# EAGLE design SEMLIC V2 (EAGLE 9.6.2)
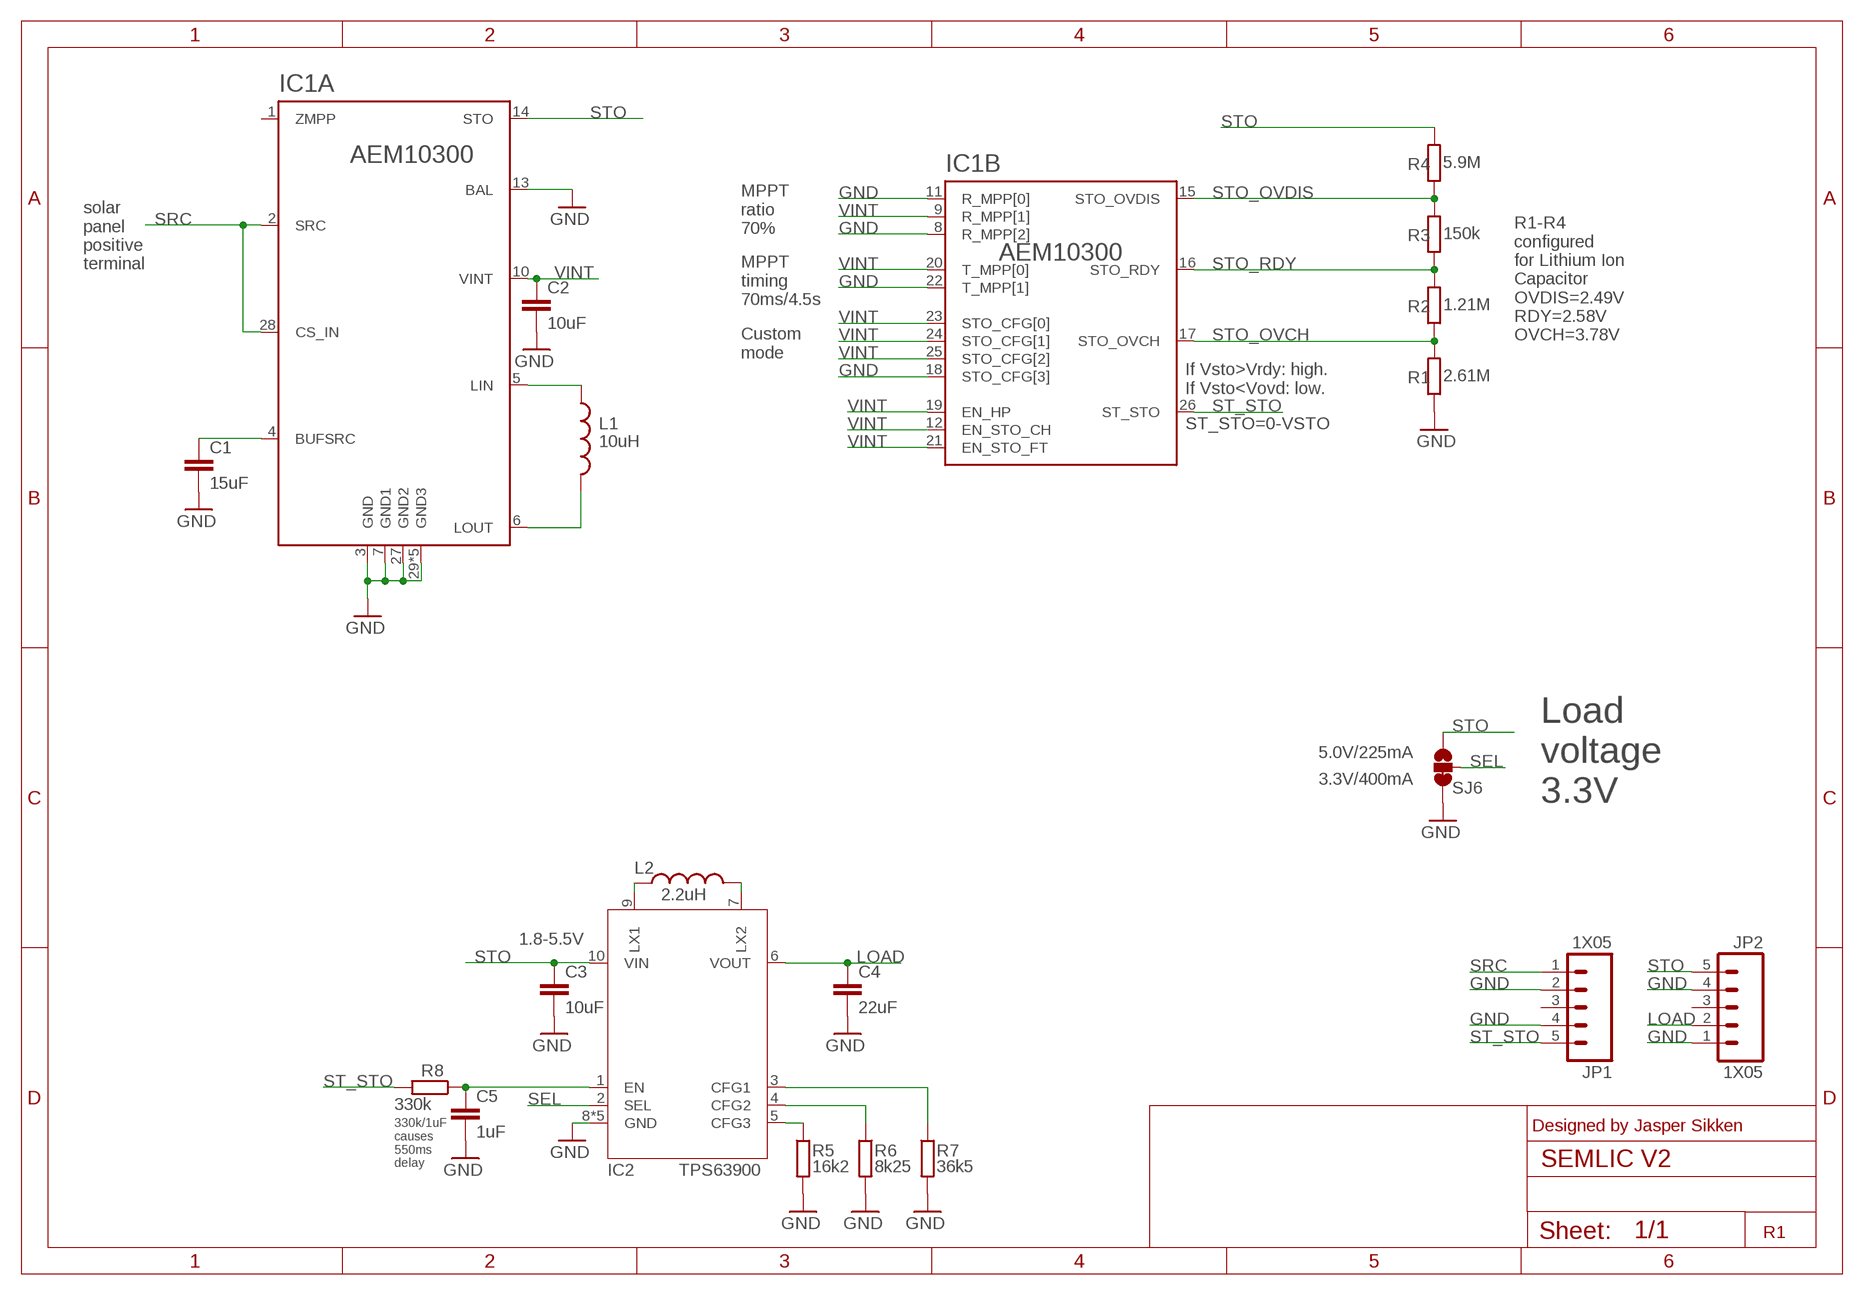
[diagram p0: schematic, sheet 1]

## Parts
C1  15uF  C_0402  [C0402]
C2  10uF  C_0402  [C0402]
C3  10uF  C0603_10UF  [C0603]
C4  22uF  C0603_22UF  [C0603]
C5  1uF  C_0402  [C0402]
IC1  AEM10300  [QFN28P4X4]
IC2  TPS63900  [WSON10]
JP1  1X05  [1X05_2.54MM_ROUND_NOSILK]
JP2  1X05  [1X05_2.54MM_ROUND_NOSILK]
L1  10uH  L  [L_1008_[2520]]
L2  2.2uH  L2  [L_1008_[2520]]
R1  2.61M  R0402_1M  [R0402]
R2  1.21M  R0402_1M  [R0402]
R3  150k  R0402_1M  [R0402]
R4  5.9M  R0402_1M  [R0402]
R5  16k2  R0402_1M  [R0402]
R6  8k25  R0402_1M  [R0402]
R7  36k5  R0402_1M  [R0402]
R8  330k  R0402_1M  [R0402]
SJ6  SOLDERJUMPER_3WAY_12SHORT3WAY  [SJ_3S_NC_0402]

## Nets
BUFSRC: C1.1 IC1.4(A:BUFSRC)
GND: C1.2 C2.2 C3.2 C4.2 C5.2 IC1.3(A:GND) IC1.7(A:GND1) IC1.8(B:R_MPP[2]) IC1.11(B:R_MPP[0]) IC1.13(A:BAL) IC1.18(B:STO_CFG[3]) IC1.22(B:T_MPP[1]) IC1.27(A:GND2) IC1.29(A:GND3) IC1.P$1(A:GND3) IC1.P$2(A:GND3) IC1.P$3(A:GND3) IC1.P$4(A:GND3) IC2.8(GND) IC2.29(GND) IC2.P$2(GND) IC2.P$4(GND) IC2.P$5(GND) JP1.2 JP1.4 JP2.1 JP2.4 R1.1 R5.2 R6.2 R7.2 SJ6.1
LIN: IC1.5(A:LIN) L1.1
LOAD: C4.1 IC2.6(VOUT) JP2.2
LOUT: IC1.6(A:LOUT) L1.2
N$2: IC2.9(LX1) L2.1
N$3: IC2.7(LX2) L2.2
N$4: IC2.5(CFG3) R5.1
N$5: IC2.4(CFG2) R6.1
N$6: IC2.3(CFG1) R7.1
SEL: IC2.2(SEL) SJ6.2
SRC: IC1.2(A:SRC) IC1.28(A:CS_IN) JP1.1
ST_STO: IC1.26(B:ST_STO) JP1.5 R8.2
STO: C3.1 IC1.14(A:STO) IC2.10(VIN) JP2.5 R4.2 SJ6.3
STO_OVCH: IC1.17(B:STO_OVCH) R1.2 R2.1
STO_OVDIS: IC1.15(B:STO_OVDIS) R3.2 R4.1
STO_RDY: IC1.16(B:STO_RDY) R2.2 R3.1
TPS_EN: C5.1 IC2.1(EN) R8.1
VINT: C2.1 IC1.9(B:R_MPP[1]) IC1.10(A:VINT) IC1.12(B:EN_STO_CH) IC1.19(B:EN_HP) IC1.20(B:T_MPP[0]) IC1.21(B:EN_STO_FT) IC1.23(B:STO_CFG[0]) IC1.24(B:STO_CFG[1]) IC1.25(B:STO_CFG[2])
Unconnected: IC1.1(A:ZMPP) JP1.3 JP2.3

## Notes on the sheet
- MPPT
  ratio
  70%
- solar
  panel
  positive
  terminal
- MPPT
  timing
  70ms/4.5s
- R1-R4 
  configured 
  for Lithium Ion 
  Capacitor
  OVDIS=2.49V
  RDY=2.58V
  OVCH=3.78V
- Custom 
  mode
- If Vsto>Vrdy: high.
  If Vsto<Vovd: low.
- ST_STO=0-VSTO
- 5.0V/225mA
- 3.3V/400mA
- Load 
  voltage
  3.3V
- 1.8-5.5V
- Designed by Jasper Sikken
- 330k/1uF 
  causes 
  550ms 
  delay
- R1

## Library data of the parts
C1 C2 C5 = TSEM:C: Non-polarized capacitor
C3 = TSEM:C: Non-polarized capacitor; FARNELL_OC: 2113070; MF: Taiyo Yuden; MPN: LMK107BBJ106MALT
C4 = TSEM:C: Non-polarized capacitor; FARNELL_OC: 2426957; MF: Murata; MPN: GRM188R61A226ME15D; VALUE: 22uF 10V
IC1 = TSEM:AEM10300: Ambient Energy Manager from e-peas
IC2 = TSEM:TPS63900: TPS63900 1.8-V to 5.5-V, 75-nA IQ Buck-boost Converter with Input Current Limit and DVS
JP1 JP2 = TSEM:1X05; OC_NEWARK: unknown
L1 = TSEM:L: Inductor; MF: MURATA; MPN: DFE252010F-100
L2 = TSEM:L: Inductor; MF: Murata; MPN: DFE252012F-2R2M=P2
R1-R8 = TSEM:R: Resistor; FARNELL_OC: 2502499; OC_NEWARK: unknown; VALUE: 1M
SJ6 = sodaq:SOLDERJUMPER_3WAY_12SHORT; OC_NEWARK: unknown

## Board
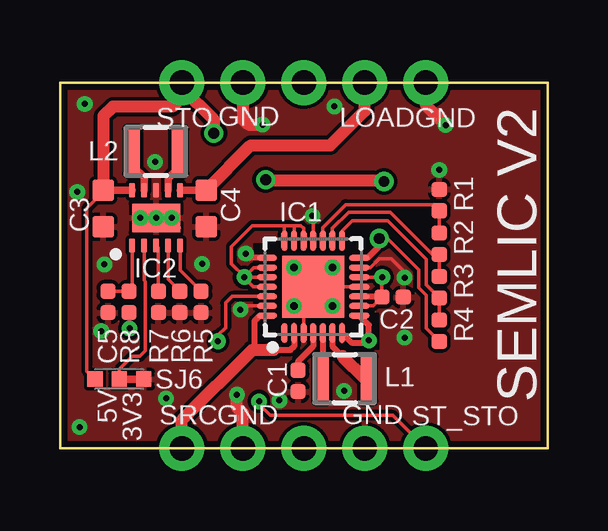
[diagram p1: board, top side]
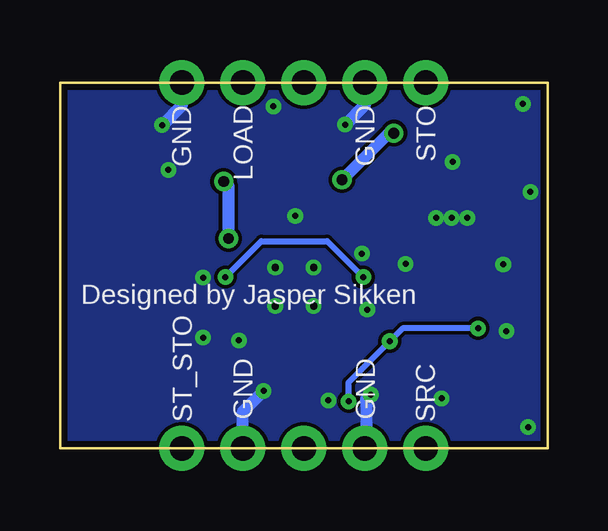
[diagram p2: board, bottom side, seen from below]

Size 20.32 x 15.24 mm. Coordinates in mm from the lower left corner, seen from the top.
Outline: 0,0 0,15.24 20.32,15.24 20.32,0 0,0
Copper layers (1*16): Top 0.018mm / dielectric 1.55mm / Bottom 0.018mm
Design rules "eC_2Layer_PClass6_BaseCopperO18_eCDefault *": minimum track width 0.15mm, minimum drill 0.25mm, track to track 0.15mm, track to pad 0.15mm, pad to pad 0.15mm, via to via 0.15mm, smd to smd 0mil, copper to edge 0.25mm, drill to drill 0.35mm, minimum pad ring 0.175mm, minimum via ring 0.125mm, stop-mask expansion 0.03mm, vias tented up to drill 0.45mm, thermal gap 0.15mm
tRestrict: area 11.6,4.2 to 13.2,5.6; area 8.1,7.8 to 9.1,8.5; area 8.1,5.8 to 8.9,6.1; area 10.4,8.5 to 10.8,9.3; area 12.3,7.4 to 13.1,7.7

### Footprints (pad centres in the part's own frame; a part is rotated, then mirrored left to right if it is on the bottom)
C0402 = smd 0.635 x 0.635: 1 -0.445,0; 2 0.445,0
C0603 = smd 0.889 x 0.889: 1 -0.762,0; 2 0.762,0
QFN28P4X4 = smd 0.85 x 0.25: 1 -1.925,1.2; 2 -1.925,0.8; 3 -1.925,0.4; 4 -1.925,0; 5 -1.925,-0.4; 6 -1.925,-0.8; 7 -1.925,-1.2; 15 1.925,-1.2; 16 1.925,-0.8; 17 1.925,-0.4; 18 1.925,0; 19 1.925,0.4; 20 1.925,0.8; 21 1.925,1.2 | smd 0.25 x 0.85: 8 -1.2,-1.925; 9 -0.8,-1.925; 10 -0.4,-1.925; 11 0,-1.925; 12 0.4,-1.925; 13 0.8,-1.925; 14 1.2,-1.925; 22 1.2,1.925; 23 0.8,1.925; 24 0.4,1.925; 25 0,1.925; 26 -0.4,1.925; 27 -0.8,1.925; 28 -1.2,1.925 | smd 2.6 x 2.6: 29 0,0 | drill 0.3: P$1 -0.8,0.8; P$2 0.8,0.8; P$3 -0.8,-0.8; P$4 0.8,-0.8
WSON10 = smd 0.6 x 0.25: 1 -1.15,1; 2 -1.15,0.5; 3 -1.15,0; 4 -1.15,-0.5; 5 -1.15,-1; 6 1.15,-1; 7 1.15,-0.5; 8 1.15,0; 9 1.15,0.5; 10 1.15,1 | smd 1.2 x 2: 29 0,0 | drill 0.25 pad 0.65: P$2 0,0; P$4 0,-0.65; P$5 0,0.65
1X05_2.54MM_ROUND_NOSILK = drill 1.016 pad 1.88: 1 0,0; 2 2.54,0; 3 5.08,0; 4 7.62,0; 5 10.16,0
L_1008_[2520] = smd 0.6 x 2: 1 -0.95,0; 2 0.95,0
R0402 = smd 0.635 x 0.635: 1 -0.445,0; 2 0.445,0
SJ_3S_NC_0402 = smd 0.635 x 0.65: 1 -1.016,0; 2 0,0; 3 1.016,0

### Placement (x,y rotation side)
C1  9.92,2.81 270 top
C2  13.86,6.3 0 top
C3  1.8,10 270 top
C4  6.1,10 270 top
C5  2,6.1 270 top
IC1  10.55,6.73 90 top
IC2  4,9.6 90 top
JP1  5.08,0 0 top
JP2  15.24,15.24 180 top
L1  11.86,2.9 0 top
L2  3.99,12.37 0 top
R1  15.8,10.34 270 top
R2  15.8,8.53 270 top
R3  15.8,6.71 270 top
R4  15.8,4.9 270 top
R5  5.88,6.1 270 top
R6  4.99,6.1 270 top
R7  4.1,6.1 270 top
R8  2.88,6.1 270 top
SJ6  2.47,2.88 180 top

### Tracks (layer width: path | path; a pad name or v marks a point on that pad's centre or on a via)
BUFSRC
  Top 0.25: IC1.4 10.55,4.25 9.92,3.62
  Top 0.254: 9.92,3.62 C1.1
GND  (via drill 0.25 pad 0.65)
  Top 0.15: 10.57,8.68 IC1.18 10.55,9.65 v10.52,9.68 | IC1.27 7.67,5.93 v7.52,5.78 | IC1.3 10.15,5.53 IC1.P$1 | IC1.13 12.93,7.53 13.3,7.9 13.8,7.9 14.36,7.34 v14.36,7.11 | IC1.11 11.47,6.73 11.35,6.85 IC1.P$4
  Top 0.152: 7.92,7.93 v7.74,8.11
  Top 0.25: IC1.22 7.92,7.93 | IC1.8 12.87,5.13 v12.87,4.5 12.77,4.4 12.15,4.4 IC1.7
  Top 0.305: 4.89,9.18 4.47,9.6 IC2.P$2 3.57,9.17
  Top 0.508: JP2.4 7.62,13.72 7.85,13.49 v8.44,13.49 | JP2.1 15.24,14.3 v16.07,13.47 | JP1.2 7.62,1.47 7.37,1.72 v7.37,2.23
  Bottom 0.508: JP1.2 7.56,0.06 7.56,2.04 v7.37,2.23 | JP1.4 12.7,1.53 v11.84,2.39 | JP2.4 7.62,14.31 v8.44,13.49 | JP2.1 15.24,14.3 v16.07,13.47
  other vias: 9.14,2 1.85,7.66 15.8,11.6 5.92,7.68 3.96,11.93 1.03,14.35 11.43,14.25 14.36,4.61 0.72,10.68 0.82,0.88 4.42,2.08 1.72,4.88
  pour Top: 0,15.24 20.32,15.24 20.32,0 0,0
  pour Bottom: 0,15.24 20.32,15.24 20.32,0 0,0
LIN
  Top 0.15: 10.95,3.15 10.9,3.1 L1.1
  Top 0.25: L1.1 | IC1.5 10.95,4.1 10.95,3.15
LOAD
  Top 0.305: IC2.6 6.09,10.75 C4.1 | JP2.2 12.7,14.58
  Top 0.508: C4.1 7.96,12.62 11.26,12.62 12.7,14.06 12.7,14.58
LOUT
  Top 0.25: 11.78,3.84 11.77,3.84 11.35,4.26 IC1.6
  Top 0.508: 11.77,3.84 12.71,2.9 L1.2
N$2
  Top 0.305: IC2.9 3.5,11.3 3.04,11.76 L2.1
N$3
  Top 0.305: IC2.7 4.5,11.25 4.92,11.67 4.92,12.35 L2.2
N$4
  Top 0.152: IC2.5 5,7.42 R5.1
N$5
  Top 0.152: IC2.4 4.5,7.04 R6.1
N$6
  Top 0.152: IC2.3 4.1,8.35 R7.1
SEL
  Top 0.15: IC2.2 3.5,7 3.56,6.94 3.56,4.06 3.33,3.83 3.01,3.83 2.47,3.29 SJ6.2
SRC
  Top 0.25: IC1.2 9.75,4.25 9.6,4.1 8.9,4.1 | IC1.28 8.33,5.53 8.1,5.3 8.1,4.1
  Top 0.508: JP1.1 5.08,1.18 8,4.1 8.1,4.1 8.9,4.1
ST_STO  (via drill 0.25 pad 0.65)
  Top 0.15: IC1.26 7.17,6.33 6.9,6.06 6.9,5.03 6.58,4.71 v6.58,4.46 | JP1.5 13.87,1.37 8.75,1.37 8.29,1.82 v8.29,1.96 | 2.81,5.58 R8.2 2.88,5.22 2.9,5.2 v2.9,5
  Bottom 0.25: v8.29,1.96 8.29,2.75 v6.58,4.46 6.04,5 v2.9,5
STO  (via drill 0.45 pad 0.8)
  Top 0.15: SJ6.3 1.12,3.21 1.12,10.01 1.68,10.57 1.9,10.57
  Top 0.152: R4.2 15.26,5 15.26,6.38 14.95,6.69 14.95,7.45 13.66,8.74 v13.3,8.74
  Top 0.25: 12.78,7.93 IC1.14 12.81,7.93 13.3,8.41 v13.3,8.74
  Top 0.254: 13.45,11.17 v13.5,11.12
  Top 0.305: 1.7,10.76 C3.1 1.81,10.75 IC2.10 | 1.89,10.57 1.9,10.57 | 8.57,11.17 v8.57,11.19
  Top 0.508: 1.89,10.57 1.83,10.63 1.83,10.73 C3.1 | 8.57,11.17 13.45,11.17 | v6.41,13.13 6.41,13.68 5.08,15.01 JP2.5 5.08,14.64 4.68,14.24 2.21,14.24 1.81,13.84 1.81,10.75
  Bottom 0.508: v8.57,11.19 6.52,13.24 v6.41,13.13 | v13.3,8.74 13.3,10.92 v13.5,11.12
STO_OVCH
  Top 0.15: IC1.17 10.95,9.2 11.9,10.15 | R1.2 R2.1
  Top 0.152: 11.9,10.15 15.55,10.15 R1.2
STO_OVDIS
  Top 0.15: 11.94,9.24 11.75,9.05 IC1.15 | R4.1 R3.2
  Top 0.152: R3.2 15.26,6.81 15.26,7.87 13.65,9.48 12.17,9.48 11.94,9.24
STO_RDY
  Top 0.15: IC1.16 11.35,9.16 12.03,9.84 | R2.2 R3.1
  Top 0.152: 12.03,9.84 13.76,9.84 15.52,8.08 R2.2
TPS_EN
  Top 0.15: IC2.1 3,6.67 R8.1 C5.1
VINT  (via drill 0.25 pad 0.65)
  Top 0.15: 13.39,6.33 C2.1 | C2.1 13.41,6.06 | 9.35,8.84 IC1.21 9.35,9.28 | IC1.19 10.15,9.16 10.03,9.28 9.75,9.28 | 9.75,9.28 9.35,9.28 | IC1.20 9.75,9.28 | 9.35,9.28 8.02,9.28 | IC1.25 8.05,6.73 7.69,7.09 | IC1.9 13.05,5.93 C2.1 | IC1.23 8.08,7.53 v7.69,7.14 | IC1.24 7.7,7.13 | IC1.12 13.41,7.13
  Top 0.152: C2.1 13.41,7.14 | 13.41,7.14 v13.42,7.14 v13.43,7.13 | v7.69,7.14 v7.68,7.13 | 7.69,7.09 v7.69,7.14 | 7.7,7.13 v7.69,7.14 | v7.69,7.14 7.14,7.69 7.14,8.4 8.02,9.28 | 13.41,7.13 13.41,7.14
  Top 0.25: IC1.10 13.39,6.33
  Bottom 0.25: v13.43,7.13 11.93,8.63 9.19,8.63 v7.68,7.13

### Text on the board
tPlace: STO | GND | LOAD | GND | SEMLIC V2 | 5V | SRC | GND | GND | ST_STO | 3V3
bPlace: STO | GND | LOAD | GND | Designed by Jasper Sikken | SRC | GND | GND | ST_STO